# EAGLE schematic Minisumo_2018_Educatiu (EAGLE 9.2.0)

## Sheet 1 of 2
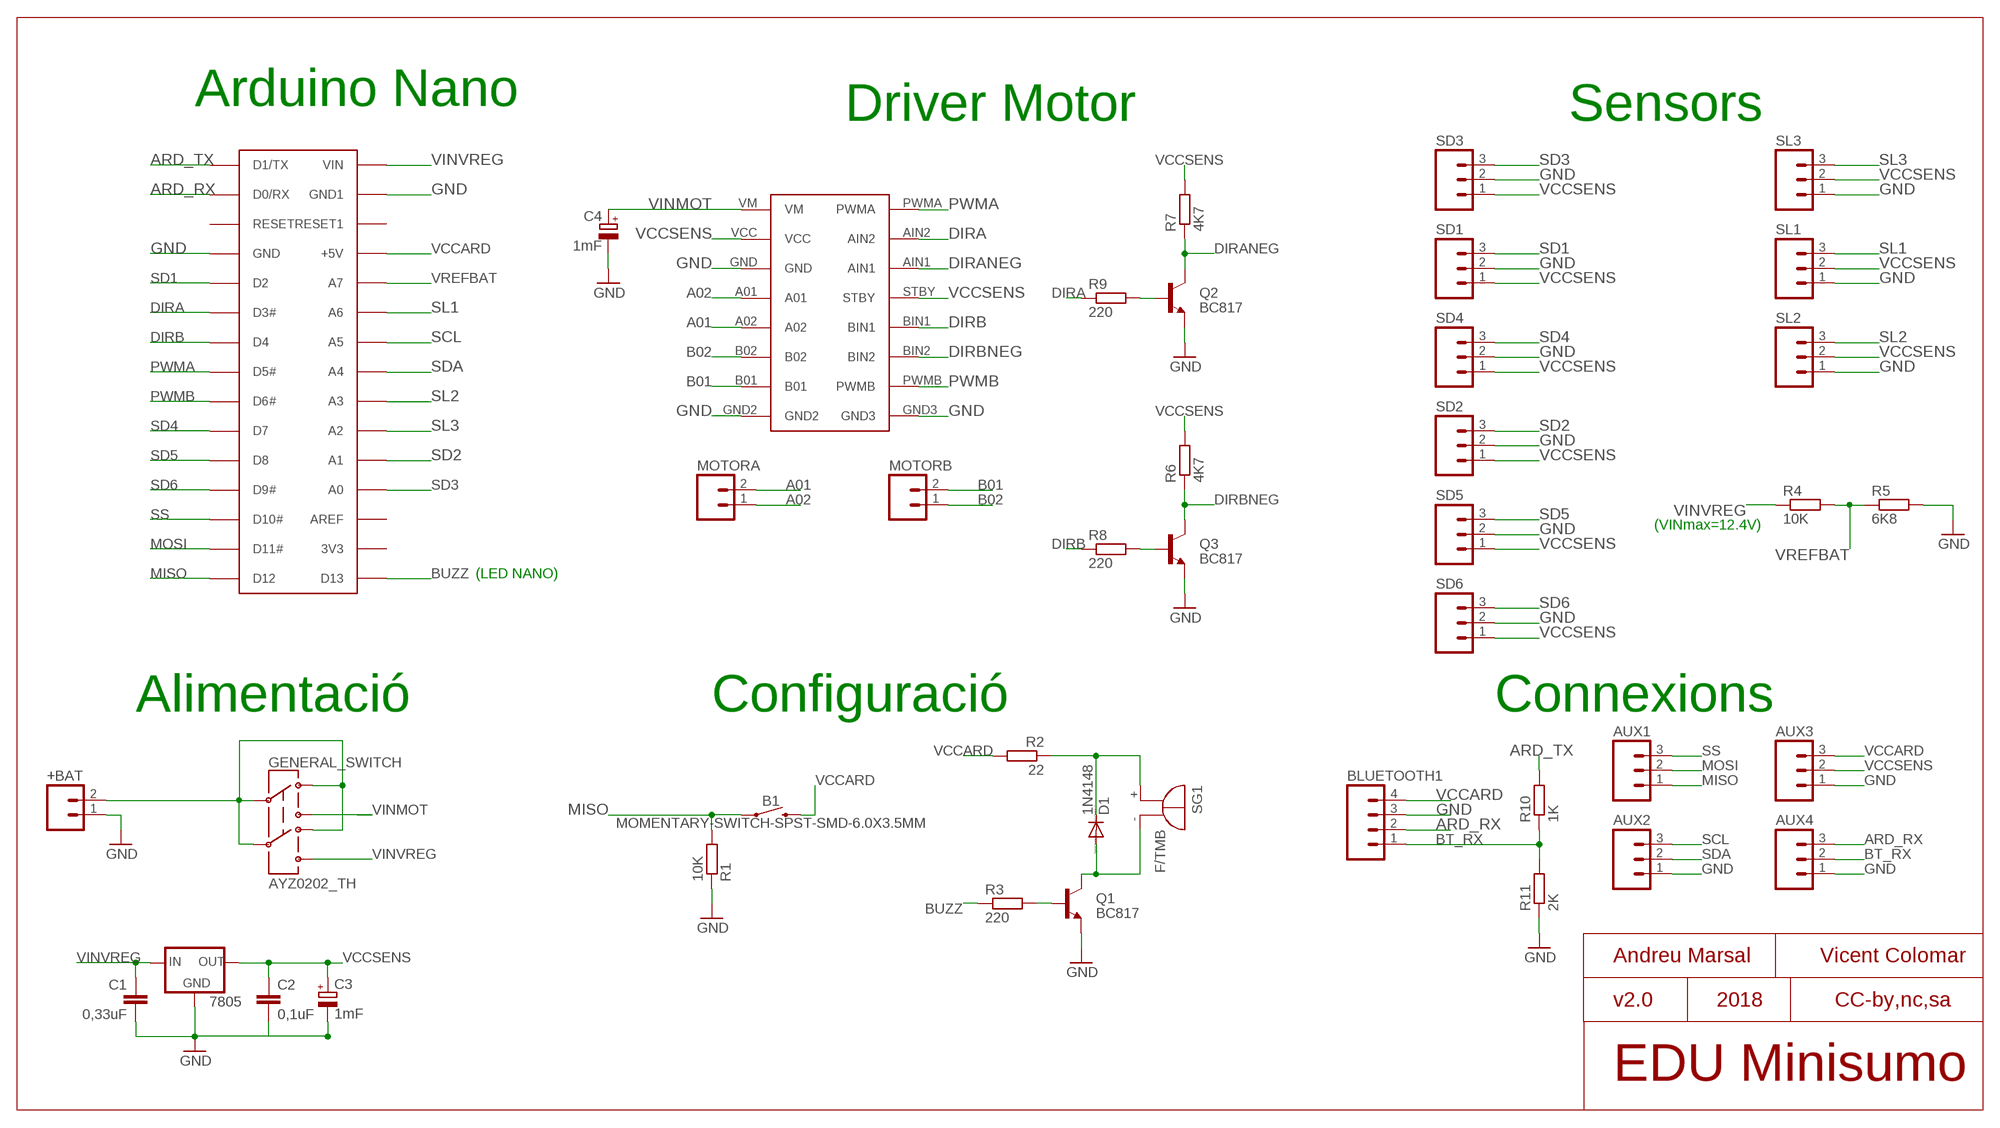
[diagram p0: schematic, sheet 1]

### Parts
7805  V_REG_78XXSINK  [TO220-IGO]
+BAT  M02LOCK_LONGPADS  [1X02_LOCK_LONGPADS]
AUX1  M03PTH  [1X03]
AUX2  M03PTH  [1X03]
AUX3  M03PTH  [1X03]
AUX4  M03PTH  [1X03]
B1  MOMENTARY-SWITCH-SPST-SMD-6.0X3.5MM  [TACTILE_SWITCH_SMD_6.0X3.5MM]
BLUETOOTH1  M04PTH  [1X04]
C1  0,33uF  C-EUC1206K  [C1206K]
C2  0,1uF  C-EUC1206K  [C1206K]
C3  1mF  CPOL-EUE2.5-6  [E2,5-6]
C4  1mF  CPOL-EUE2.5-6  [E2,5-6]
D1  1N4148  DIODE-SOD106-R  [SOD106-R]
GENERAL_SWITCH  AYZ0202_TH  [AYZ0202_TH]
MOTORA  M023.5MM  [SCREWTERMINAL-3.5MM-2]
MOTORB  M023.5MM  [SCREWTERMINAL-3.5MM-2]
Q1  BC817  TRANSISTOR_NPNTO92  [TO-92]
Q2  BC817  TRANSISTOR_NPNTO92  [TO-92]
Q3  BC817  TRANSISTOR_NPNTO92  [TO-92]
R1  10K  R-EU_R1206  [R1206]
R2  22  R-EU_R1206  [R1206]
R3  220  R-EU_M1206  [M1206]
R4  10K  R-EU_R1206  [R1206]
R5  6K8  R-EU_R1206  [R1206]
R6  4K7  R-EU_M1206  [M1206]
R7  4K7  R-EU_M1206  [M1206]
R8  220  R-EU_M1206  [M1206]
R9  220  R-EU_M1206  [M1206]
R10  1K  R-EU_R1206  [R1206]
R11  2K  R-EU_R1206  [R1206]
SD1  M03PTH  [1X03]
SD2  M03PTH  [1X03]
SD3  M03PTH  [1X03]
SD4  M03PTH  [1X03]
SD5  M03PTH  [1X03]
SD6  M03PTH  [1X03]
SG1  F/TMB  [F/TMB]
SL1  M03PTH  [1X03]
SL2  M03PTH  [1X03]
SL3  M03PTH  [1X03]
U$1  ARDUINONANONOHOLES  [PDIP-32NOHOLES]
U$2  TB6612FNG_SPARKFUN  [TB6612FNG_SPARKFUN]

### Nets
A01: MOTORA.2 U$2.A02
A02: MOTORA.1 U$2.A01
ARD_RX: AUX4.3 BLUETOOTH1.2 U$1.D0/RX ; also sheet 2
ARD_TX: R10.2 U$1.D1/TX ; also sheet 2
B01: MOTORB.2 U$2.B01
B02: MOTORB.1 U$2.B02
BT_RX: AUX4.2 BLUETOOTH1.1 R10.1 R11.2
BUZZ: R3.1 U$1.D13
DIRA: R9.1 U$1.D3(D3#) U$2.AIN2
DIRANEG: Q2.3(C) R7.1 U$2.AIN1
DIRB: R8.1 U$1.D4 U$2.BIN1
DIRBNEG: Q3.3(C) R6.1 U$2.BIN2
GND: 7805.GND +BAT.1 AUX2.1 AUX3.1 AUX4.1 BLUETOOTH1.3 C1.2 C2.2 C3.- C4.- Q1.1(E) Q2.1(E) Q3.1(E) R1.1 R5.2 R11.1 SD1.2 SD2.2 SD3.2 SD4.2 SD5.2 SD6.2 SL1.1 SL2.1 SL3.1 U$1.GND U$1.GND1 U$2.GND U$2.GND2 U$2.GND3 ; also sheet 2
MISO: AUX1.1 B1.1 R1.2 U$1.D12 ; also sheet 2
MOSI: AUX1.2 U$1.D11(D11#) ; also sheet 2
N$3: Q1.2(B) R3.2
N$5: D1.A Q1.3(C) SG1.-
N$6: Q2.2(B) R9.2
N$7: D1.C R2.1 SG1.+
N$9: Q3.2(B) R8.2
PWMA: U$1.D5(D5#) U$2.PWMA
PWMB: U$1.D6(D6#) U$2.PWMB
SCL: AUX2.3 U$1.A5 ; also sheet 2
SD1: SD1.3 U$1.D2
SD2: SD2.3 U$1.A1
SD3: SD3.3 U$1.A0
SD4: SD4.3 U$1.D7
SD5: SD5.3 U$1.D8
SD6: SD6.3 U$1.D9(D9#)
SDA: AUX2.2 U$1.A4 ; also sheet 2
SL1: SL1.3 U$1.A6
SL2: SL2.3 U$1.A3
SL3: SL3.3 U$1.A2
SS: AUX1.3 U$1.D10(D10#) ; also sheet 2
VBAT: +BAT.2 GENERAL_SWITCH.C1 GENERAL_SWITCH.C2 GENERAL_SWITCH.D1 GENERAL_SWITCH.D2
VCCARD: AUX3.3 B1.2 BLUETOOTH1.4 R2.2 U$1.+5V ; also sheet 2
VCCSENS: 7805.OUT AUX3.2 C2.1 C3.+ R6.2 R7.2 SD1.1 SD2.1 SD3.1 SD4.1 SD5.1 SD6.1 SL1.2 SL2.2 SL3.2 U$2.STBY U$2.VCC ; also sheet 2
VINMOT: C4.+ GENERAL_SWITCH.B1 U$2.VM
VINVREG: 7805.IN C1.1 GENERAL_SWITCH.B2 R4.1 U$1.VIN ; also sheet 2
VREFBAT: R4.2 R5.1 U$1.A7
Unconnected: U$1.3V3 U$1.AREF U$1.RESET U$1.RESET1

### Notes on the sheet
- Arduino Nano | Driver Motor | Sensors
- (VINmax=12.4V)
- (LED NANO)
- Alimentació | Configuració | Connexions
- Andreu Marsal | Vicent Colomar
- v2.0 | 2018 | CC-by,nc,sa
- EDU Minisumo

## Sheet 2 of 2
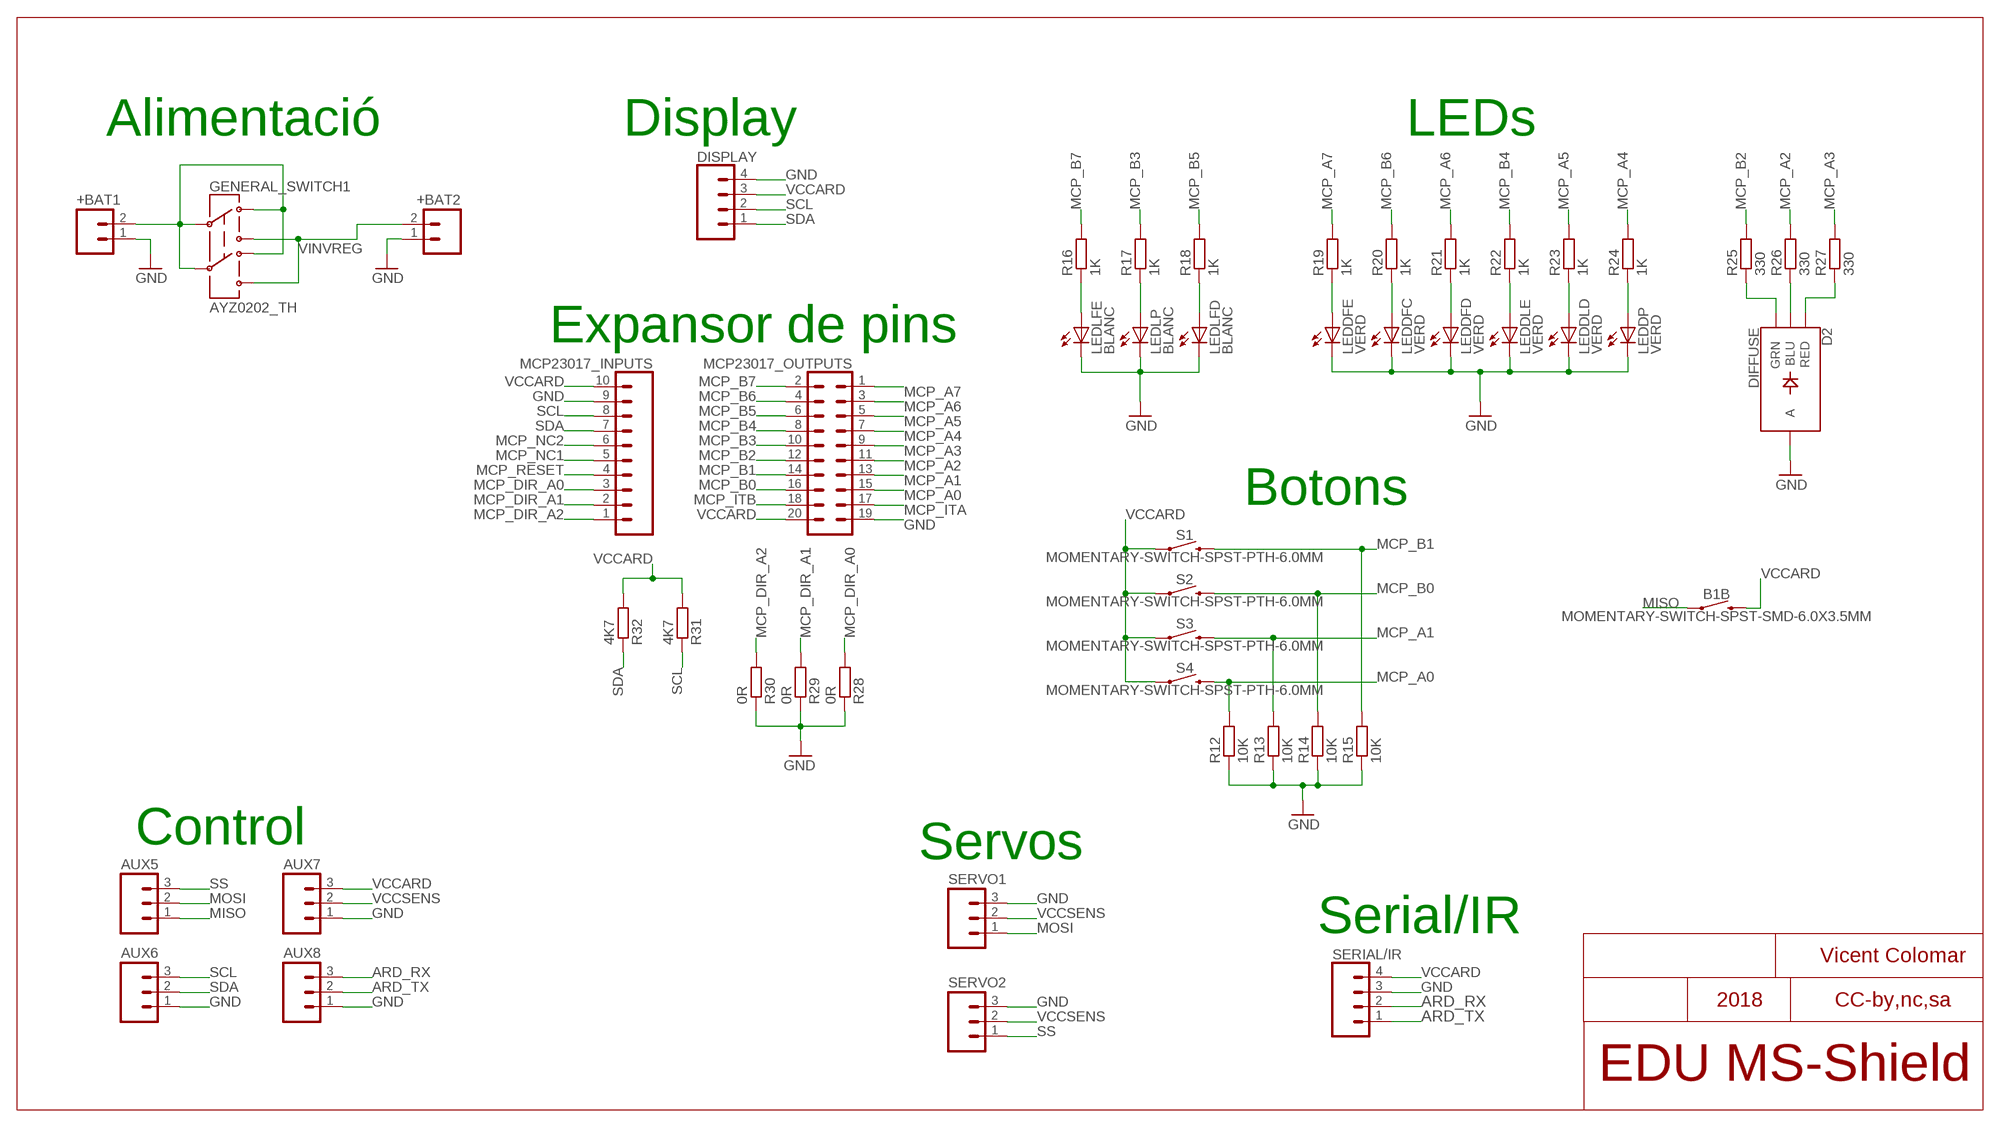
[diagram p1: schematic, sheet 2]

### Parts
+BAT1  M02LOCK_LONGPADS  [1X02_LOCK_LONGPADS]
+BAT2  M02LOCK_LONGPADS  [1X02_LOCK_LONGPADS]
AUX5  M03PTH  [1X03]
AUX6  M03PTH  [1X03]
AUX7  M03PTH  [1X03]
AUX8  M03PTH  [1X03]
B1B  MOMENTARY-SWITCH-SPST-SMD-6.0X3.5MM  [TACTILE_SWITCH_SMD_6.0X3.5MM]
D2  DIFFUSE  LED-RGB-CADIFFUSE  [LED-RGB-THRU]
DISPLAY  CONN_04  [1X04]
GENERAL_SWITCH1  AYZ0202_TH  [AYZ0202_TH]
LEDDFC  VERD  LEDSMT1206  [1206]
LEDDFD  VERD  LEDSMT1206  [1206]
LEDDFE  VERD  LEDSMT1206  [1206]
LEDDLD  VERD  LEDSMT1206  [1206]
LEDDLE  VERD  LEDSMT1206  [1206]
LEDDP  VERD  LEDSMT1206  [1206]
LEDLFD  BLANC  LEDSMT1206  [1206]
LEDLFE  BLANC  LEDSMT1206  [1206]
LEDLP  BLANC  LEDSMT1206  [1206]
MCP23017_INPUTS  CONN_10"  [1X10]
MCP23017_OUTPUTS  CONN_10X2  [2X10]
R12  10K  R-EU_M1206  [M1206]
R13  10K  R-EU_M1206  [M1206]
R14  10K  R-EU_M1206  [M1206]
R15  10K  R-EU_M1206  [M1206]
R16  1K  R-EU_M1206  [M1206]
R17  1K  R-EU_M1206  [M1206]
R18  1K  R-EU_M1206  [M1206]
R19  1K  R-EU_M1206  [M1206]
R20  1K  R-EU_M1206  [M1206]
R21  1K  R-EU_M1206  [M1206]
R22  1K  R-EU_M1206  [M1206]
R23  1K  R-EU_M1206  [M1206]
R24  1K  R-EU_M1206  [M1206]
R25  330  R-EU_M1206  [M1206]
R26  330  R-EU_M1206  [M1206]
R27  330  R-EU_M1206  [M1206]
R28  0R  R-EU_M1206  [M1206]
R29  0R  R-EU_M1206  [M1206]
R30  0R  R-EU_M1206  [M1206]
R31  4K7  R-EU_M1206  [M1206]
R32  4K7  R-EU_M1206  [M1206]
S1  MOMENTARY-SWITCH-SPST-PTH-6.0MM  [TACTILE_SWITCH_PTH_6.0MM]
S2  MOMENTARY-SWITCH-SPST-PTH-6.0MM  [TACTILE_SWITCH_PTH_6.0MM]
S3  MOMENTARY-SWITCH-SPST-PTH-6.0MM  [TACTILE_SWITCH_PTH_6.0MM]
S4  MOMENTARY-SWITCH-SPST-PTH-6.0MM  [TACTILE_SWITCH_PTH_6.0MM]
SERIAL/IR  CONN_04  [1X04]
SERVO1  M03PTH  [1X03]
SERVO2  M03PTH  [1X03]

### Nets
ARD_RX: AUX8.3 SERIAL/IR.2 ; also sheet 1
ARD_TX: AUX8.2 SERIAL/IR.1 ; also sheet 1
GND: +BAT1.1 +BAT2.1 AUX6.1 AUX7.1 AUX8.1 D2.2(A) DISPLAY.4 LEDDFC.C LEDDFD.C LEDDFE.C LEDDLD.C LEDDLE.C LEDDP.C LEDLFD.C LEDLFE.C LEDLP.C MCP23017_INPUTS.9 MCP23017_OUTPUTS.19 R12.1 R13.1 R14.1 R15.1 R28.1 R29.1 R30.1 SERIAL/IR.3 SERVO1.3 SERVO2.3 ; also sheet 1
MCP_A0: MCP23017_OUTPUTS.15 R12.2 S4.3
MCP_A1: MCP23017_OUTPUTS.13 R13.2 S3.3
MCP_A2: MCP23017_OUTPUTS.11 R26.2
MCP_A3: MCP23017_OUTPUTS.9 R27.2
MCP_A4: MCP23017_OUTPUTS.7 R24.2
MCP_A5: MCP23017_OUTPUTS.5 R23.2
MCP_A6: MCP23017_OUTPUTS.3 R21.2
MCP_A7: MCP23017_OUTPUTS.1 R19.2
MCP_B0: MCP23017_OUTPUTS.16 R14.2 S2.3
MCP_B1: MCP23017_OUTPUTS.14 R15.2 S1.3
MCP_B2: MCP23017_OUTPUTS.12 R25.2
MCP_B3: MCP23017_OUTPUTS.10 R17.2
MCP_B4: MCP23017_OUTPUTS.8 R22.2
MCP_B5: MCP23017_OUTPUTS.6 R18.2
MCP_B6: MCP23017_OUTPUTS.4 R20.2
MCP_B7: MCP23017_OUTPUTS.2 R16.2
MCP_DIR_A0: MCP23017_INPUTS.3 R28.2
MCP_DIR_A1: MCP23017_INPUTS.2 R29.2
MCP_DIR_A2: MCP23017_INPUTS.1 R30.2
MCP_ITA: MCP23017_OUTPUTS.17
MCP_ITB: MCP23017_OUTPUTS.18
MCP_NC1: MCP23017_INPUTS.5
MCP_NC2: MCP23017_INPUTS.6
MCP_RESET: MCP23017_INPUTS.4
MISO: AUX5.1 B1B.1 ; also sheet 1
MOSI: AUX5.2 SERVO1.1 ; also sheet 1
N$10: D2.3(GRN) R25.1
N$11: LEDLFE.A R16.1
N$12: LEDLP.A R17.1
N$13: LEDLFD.A R18.1
N$18: LEDDFE.A R19.1
N$19: LEDDFC.A R20.1
N$20: LEDDFD.A R21.1
N$21: LEDDLE.A R22.1
N$22: LEDDLD.A R23.1
N$23: LEDDP.A R24.1
N$30: D2.4(BLU) R26.1
N$31: D2.1(RED) R27.1
SCL: AUX6.3 DISPLAY.2 MCP23017_INPUTS.8 R31.1 ; also sheet 1
SDA: AUX6.2 DISPLAY.1 MCP23017_INPUTS.7 R32.1 ; also sheet 1
SS: AUX5.3 SERVO2.1 ; also sheet 1
VBAT1: +BAT1.2 GENERAL_SWITCH1.C1 GENERAL_SWITCH1.C2 GENERAL_SWITCH1.D1 GENERAL_SWITCH1.D2
VCCARD: AUX7.3 B1B.2 DISPLAY.3 MCP23017_INPUTS.10 MCP23017_OUTPUTS.20 R31.2 R32.2 S1.1 S2.1 S3.1 S4.1 SERIAL/IR.4 ; also sheet 1
VCCSENS: AUX7.2 SERVO1.2 SERVO2.2 ; also sheet 1
VINVREG: +BAT2.2 GENERAL_SWITCH1.B1 GENERAL_SWITCH1.B2 ; also sheet 1

### Notes on the sheet
- Alimentació | Display | LEDs
- Expansor de pins
- Botons
- Control | Servos
- Serial/IR
- Vicent Colomar
- 2018 | CC-by,nc,sa
- EDU MS-Shield

## Library data of the parts
7805 = SparkFun:V_REG_78XX: Voltage Regulator Standard 7805 5V regulator. IGO (Input Ground Output). Spark Fun Electronics SKU : COM-00107
+BAT +BAT1 +BAT2 MOTORA MOTORB = SparkFun:M02: Header 2 Standard 2-pin 0.1" header. Use with straight break away headers (SKU : PRT-00116), right angle break away headers (PRT-00553), swiss pins (PRT-00743), machine pins (PRT-00117), and female headers (PRT-00115). Molex polarized connector foot print use with SKU : PRT-08233 with associated crimp pins and housings.
AUX1-AUX8 SD1-SD6 SERVO1 SERVO2 SL1-SL3 = SparkFun:M03: Header 3 Standard 3-pin 0.1" header. Use with straight break away headers (SKU : PRT-00116), right angle break away headers (PRT-00553), swiss pins (PRT-00743), machine pins (PRT-00117), and female headers (PRT-00115). Molex polarized connector foot print use with SKU : PRT-08232 with associated crimp pins and housings.
B1 B1B = SparkFun-Switches:MOMENTARY-SWITCH-SPST: Momentary Switch (Pushbutton) - SPST Normally-open (NO) SPST momentary switches (buttons, pushbuttons). Variants PTH-12MM - 12mm square, through-hole Momentary Pushbutton Switch - 12mm Square <https://www.sparkfun.com/products/9190> (COM-09190) PTH-6.0MM, PTH-6.0MM-KIT - 6.0mm square, through-hole Mini Pushbutton Switch <https://www.sparkfun.com/products/97> (COM-00097) KIT package intended for soldering kit's - only one side of pads' copper is exposed. PTH-RIGHT-ANGLE-KIT - Right-angle, through-hole Right Angle Tactile Button <https://www.sparkfun.com/products/10791> - Used on SparkFun BigTime Watch Kit <https://www.sparkfun.com/products/11734> SMD-12MM - 12mm square, surface-mount Tactile Button - SMD (12mm) <https://www.sparkfun.com/products/12993> (COM-12993) Used on SparkFun PicoBoard <https://www.sparkfun.com/products/11888> SMD-4.5MM - 4.5mm Square Trackball Switch Used on SparkFun Blackberry Trackballer Breakout <https://www.sparkfun.com/products/13169> SMD-4.6MMX2.8MM - 4.60mm x 2.80mm, surface mount Used on SparkFun SAMD21 Mini Breakout <https://www.sparkfun.com/products/13664> SMD-5.2MM, SMD-5.2-REDUNDANT - 5.2mm square, surface-mount Mini Pushbutton Switch - SMD <https://www.sparkfun.com/products/8720> (COM-08720) Used on Arduino Pro Mini <https://www.sparkfun.com/products/11114> REDUNDANT package connects both switch circuits together SMD-6.0X3.5MM - 6.0 x 3.5mm, surface mount Momentary Reset Switch SMD <https://www.sparkfun.com/products/8229> (COM-08229) SMD-6.2MM-TALL - 6.2mm square, surface mount Tactile Button - SMD (6mm) <https://www.sparkfun.com/products/12992> Used on SparkFun Digital Sandbox <https://www.sparkfun.com/products/12651> SMD-RIGHT-ANGLE - Right-angle, surface mount Used on SparkFun Block for Intel® Edison - Arduino <https://www.sparkfun.com/products/13036>; PROD_ID: SWCH-00815; SF_SKU: COM-08229
BLUETOOTH1 = SparkFun:M04: Header 4 Standard 4-pin 0.1" header. Use with straight break away headers (SKU : PRT-00116), right angle break away headers (PRT-00553), swiss pins (PRT-00743), machine pins (PRT-00117), and female headers (PRT-00115). Molex polarized connector foot print use with SKU : PRT-08231 with associated crimp pins and housings. 1MM SMD Version SKU: PRT-10208
C1 C2 = rcl:C-EU: CAPACITOR, European symbol; SPICEPREFIX: C
C3 C4 = rcl:CPOL-EU: POLARIZED CAPACITOR, European symbol; SPICEPREFIX: C
D1 = diode:DIODE-: DIODE
D2 = SparkFun-LED:LED-RGB-CA: LED-RGB Diffused Common Anode Packages: LED RGB-THRU P-LCC-4-3 LED-TRICOLOR-SMD SparkFun Products: RGB Diffused Common Anode- Diffuse <[https://www.sparkfun.com/products/10821]> RGB Diffused Common Anode - Clear <[https://www.sparkfun.com/products/10820]> Qduino Mini <[https://www.sparkfun.com/products/13614]> Triple Output LED RGB - SMD <https://www.sparkfun.com/products/7844>; PROD_ID: DIO-10632
DISPLAY SERIAL/IR = SparkFun-Connectors:CONN_04: Multi connection point. Often used as Generic Header-pin footprint for 0.1 inch spaced/style header connections On any of the 0.1 inch spaced packages, you can populate with these: Break Away Headers - Straight <https://www.sparkfun.com/products/116> (PRT-00116) Break Away Male Headers - Right Angle <https://www.sparkfun.com/products/553> (PRT-00553) Female Headers <https://www.sparkfun.com/products/115> (PRT-00115) Break Away Headers - Machine Pin <https://www.sparkfun.com/products/117> (PRT-00117) Break Away Female Headers - Swiss Machine Pin <https://www.sparkfun.com/products/743> (PRT-00743) For SCREWTERMINALS and SPRING TERMINALS visit here: Screw Terimnals on SparkFun.com <https://www.sparkfun.com/search/results?term=Screw+Terminals> (5mm/3.5mm/2.54mm spacing) This device is also useful as a general connection point to wire up your design to another part of your project. Our various solder wires solder well into these plated through hole pads. Hook-Up Wire - Assortment (Stranded, 22 AWG) <https://www.sparkfun.com/products/11375> (PRT-11375) Hook-Up Wire - Assortment (Solid Core, 22 AWG) <https://www.sparkfun.com/products/11367> (PRT-11367) View the entire wire category on our website here <https://www.sparkfun.com/categories/141> Special notes: Molex polarized connector foot print use with SKU : PRT-08231 with associated crimp pins and housings. 1MM SMD Version SKU: PRT-10208; PROD_ID: CONN-09696
GENERAL_SWITCH GENERAL_SWITCH1 = 1r_BAT_guissona:AYZ0202_TH
LEDDFC LEDDFD LEDDFE LEDDLD LEDDLE LEDDP LEDLFD LEDLFE LEDLP = led:LED: LED OSRAM: - CHIPLED LG R971, LG N971, LY N971, LG Q971, LY Q971, LO R971, LY R971 LH N974, LH R974 LS Q976, LO Q976, LY Q976 LO Q996 - Hyper CHIPLED LW Q18S LB Q993, LB Q99A, LB R99A - SideLED LS A670, LO A670, LY A670, LG A670, LP A670 LB A673, LV A673, LT A673, LW A673 LH A674 LY A675 LS A676, LA A676, LO A676, LY A676, LW A676 LS A679, LY A679, LG A679 - Hyper Micro SIDELED® LS Y876, LA Y876, LO Y876, LY Y876 LT Y87S - SmartLED LW L88C, LW L88S LB L89C, LB L89S, LG L890 LS L89K, LO L89K, LY L89K LS L896, LA L896, LO L896, LY L896 - TOPLED LS T670, LO T670, LY T670, LG T670, LP T670 LSG T670, LSP T670, LSY T670, LOP T670, LYG T670 LG T671, LOG T671, LSG T671 LB T673, LV T673, LT T673, LW T673 LH T674 LS T676, LA T676, LO T676, LY T676, LB T676, LH T676, LSB T676, LW T676 LB T67C, LV T67C, LT T67C, LS T67K, LO T67K, LY T67K, LW E67C LS E67B, LA E67B, LO E67B, LY E67B, LB E67C, LV E67C, LT E67C LW T67C LS T679, LY T679, LG T679 LS T770, LO T770, LY T770, LG T770, LP T770 LB T773, LV T773, LT T773, LW T773 LH T774 LS E675, LA E675, LY E675, LS T675 LS T776, LA T776, LO T776, LY T776, LB T776 LHGB T686 LT T68C, LB T68C - Hyper Mini TOPLED® LB M676 - Mini TOPLED Santana® LG M470 LS M47K, LO M47K, LY M47K Source: http://www.osram.convergy.de LUXEON: - LUMILED® LXK2-PW12-R00, LXK2-PW12-S00, LXK2-PW14-U00, LXK2-PW14-V00 LXK2-PM12-R00, LXK2-PM12-S00, LXK2-PM14-U00 LXK2-PE12-Q00, LXK2-PE12-R00, LXK2-PE12-S00, LXK2-PE14-T00, LXK2-PE14-U00 LXK2-PB12-K00, LXK2-PB12-L00, LXK2-PB12-M00, LXK2-PB14-N00, LXK2-PB14-P00, LXK2-PB14-Q00 LXK2-PR12-L00, LXK2-PR12-M00, LXK2-PR14-Q00, LXK2-PR14-R00 LXK2-PD12-Q00, LXK2-PD12-R00, LXK2-PD12-S00 LXK2-PH12-R00, LXK2-PH12-S00 LXK2-PL12-P00, LXK2-PL12-Q00, LXK2-PL12-R00 Source: www.luxeon.com KINGBRIGHT: KA-3528ASYC Source: www.kingbright.com
MCP23017_INPUTS = SparkFun-Connectors:CONN_10: Multi connection point. Often used as Generic Header-pin footprint for 0.1 inch spaced/style header connections On any of the 0.1 inch spaced packages, you can populate with these: Break Away Headers - Straight <https://www.sparkfun.com/products/116> (PRT-00116) Break Away Male Headers - Right Angle <https://www.sparkfun.com/products/553> (PRT-00553) Female Headers <https://www.sparkfun.com/products/115> (PRT-00115) Break Away Headers - Machine Pin <https://www.sparkfun.com/products/117> (PRT-00117) Break Away Female Headers - Swiss Machine Pin <https://www.sparkfun.com/products/743> (PRT-00743) Arduino Stackable Header - 10 Pin <https://www.sparkfun.com/products/11376> (PRT-11376) For SCREWTERMINALS and SPRING TERMINALS visit here: Screw Terimnals on SparkFun.com <https://www.sparkfun.com/search/results?term=Screw+Terminals> (5mm/3.5mm/2.54mm spacing) This device is also useful as a general connection point to wire up your design to another part of your project. Our various solder wires solder well into these plated through hole pads. Hook-Up Wire - Assortment (Stranded, 22 AWG) <https://www.sparkfun.com/products/11375> (PRT-11375) Hook-Up Wire - Assortment (Solid Core, 22 AWG) <https://www.sparkfun.com/products/11367> (PRT-11367) View the entire wire category on our website here <https://www.sparkfun.com/categories/141> Special notes: Molex polarized connector foot print use with SKU : PRT-08231 with associated crimp pins and housings. 1MM SMD Version SKU: PRT-10208 NOTES ON THE VARIANTS LOCK and LOCK_LONGPADS... This footprint was designed to help hold the alignment of a through-hole component (i.e. 6-pin header) while soldering it into place. You may notice that each hole has been shifted either up or down by 0.005 of an inch from it's more standard position (which is a perfectly straight line). This slight alteration caused the pins (the squares in the middle) to touch the edges of the holes. Because they are alternating, it causes a "brace" to hold the component in place. 0.005 has proven to be the perfect amount of "off-center" position when using our standard breakaway headers. Although looks a little odd when you look at the bare footprint, once you have a header in there, the alteration is very hard to notice. Also,if you push a header all the way into place, it is covered up entirely on the bottom side.; PROD_ID: CONN-11563
MCP23017_OUTPUTS = SparkFun-Connectors:CONN_10X2: Multi connection point. Often used as Generic Header-pin footprint for 0.1 inch spaced/style header connections On any of the 0.1 inch spaced packages, you can populate with these: Break Away Headers - Straight <https://www.sparkfun.com/products/116> (PRT-00116) Break Away Male Headers - Right Angle <https://www.sparkfun.com/products/553> (PRT-00553) Female Headers <https://www.sparkfun.com/products/115> (PRT-00115) Break Away Headers - Machine Pin <https://www.sparkfun.com/products/117> (PRT-00117) Break Away Female Headers - Swiss Machine Pin <https://www.sparkfun.com/products/743> (PRT-00743) Special note about the "SPECIAL" package: This was SPECIALLY designed to be used with our Graphic LCD Backpack. Be sure you want to use this! It is not only staggered on each line of header holes, but IT IS ALSO offset of the center point of the top and bottom lines by 5 mil. This causes the headers to lock into place on the "standard" footprint on the LCD screen. The extra squares on the tdocu layer are there simply to reference other pins (if you were to actually populate a longer header than ten long - this is what we do with the backpacks).
Q1-Q3 = SparkFun:TRANSISTOR_NPN: Transistor NPN BJT configuration in SOT23 package. MMBT2222 is the common NPN we use. Double check BCE configuration again layout.
R1 R2 R4 R5 R10 R11 = resistor:R-EU_: RESISTOR, European symbol
R3 R6-R9 R12-R32 = rcl:R-EU_: RESISTOR, European symbol; SPICEPREFIX: R
S1-S4 = SparkFun-Switches:MOMENTARY-SWITCH-SPST: Momentary Switch (Pushbutton) - SPST Normally-open (NO) SPST momentary switches (buttons, pushbuttons). Variants PTH-12MM - 12mm square, through-hole Momentary Pushbutton Switch - 12mm Square <https://www.sparkfun.com/products/9190> (COM-09190) PTH-6.0MM, PTH-6.0MM-KIT - 6.0mm square, through-hole Mini Pushbutton Switch <https://www.sparkfun.com/products/97> (COM-00097) KIT package intended for soldering kit's - only one side of pads' copper is exposed. PTH-RIGHT-ANGLE-KIT - Right-angle, through-hole Right Angle Tactile Button <https://www.sparkfun.com/products/10791> - Used on SparkFun BigTime Watch Kit <https://www.sparkfun.com/products/11734> SMD-12MM - 12mm square, surface-mount Tactile Button - SMD (12mm) <https://www.sparkfun.com/products/12993> (COM-12993) Used on SparkFun PicoBoard <https://www.sparkfun.com/products/11888> SMD-4.5MM - 4.5mm Square Trackball Switch Used on SparkFun Blackberry Trackballer Breakout <https://www.sparkfun.com/products/13169> SMD-4.6MMX2.8MM - 4.60mm x 2.80mm, surface mount Used on SparkFun SAMD21 Mini Breakout <https://www.sparkfun.com/products/13664> SMD-5.2MM, SMD-5.2-REDUNDANT - 5.2mm square, surface-mount Mini Pushbutton Switch - SMD <https://www.sparkfun.com/products/8720> (COM-08720) Used on Arduino Pro Mini <https://www.sparkfun.com/products/11114> REDUNDANT package connects both switch circuits together SMD-6.0X3.5MM - 6.0 x 3.5mm, surface mount Momentary Reset Switch SMD <https://www.sparkfun.com/products/8229> (COM-08229) SMD-6.2MM-TALL - 6.2mm square, surface mount Tactile Button - SMD (6mm) <https://www.sparkfun.com/products/12992> Used on SparkFun Digital Sandbox <https://www.sparkfun.com/products/12651> SMD-RIGHT-ANGLE - Right-angle, surface mount Used on SparkFun Block for Intel® Edison - Arduino <https://www.sparkfun.com/products/13036>; PROD_ID: SWCH-08441; SF_SKU: COM-00097
SG1 = buzzer:F/TMB: BUZZER Source: Buerklin; OC_FARNELL: unknown; OC_NEWARK: unknown
U$1 = jet-lib:ARDUINONANO
U$2 = 1r_BAT_guissona:TB6612FNG_SPARKFUN